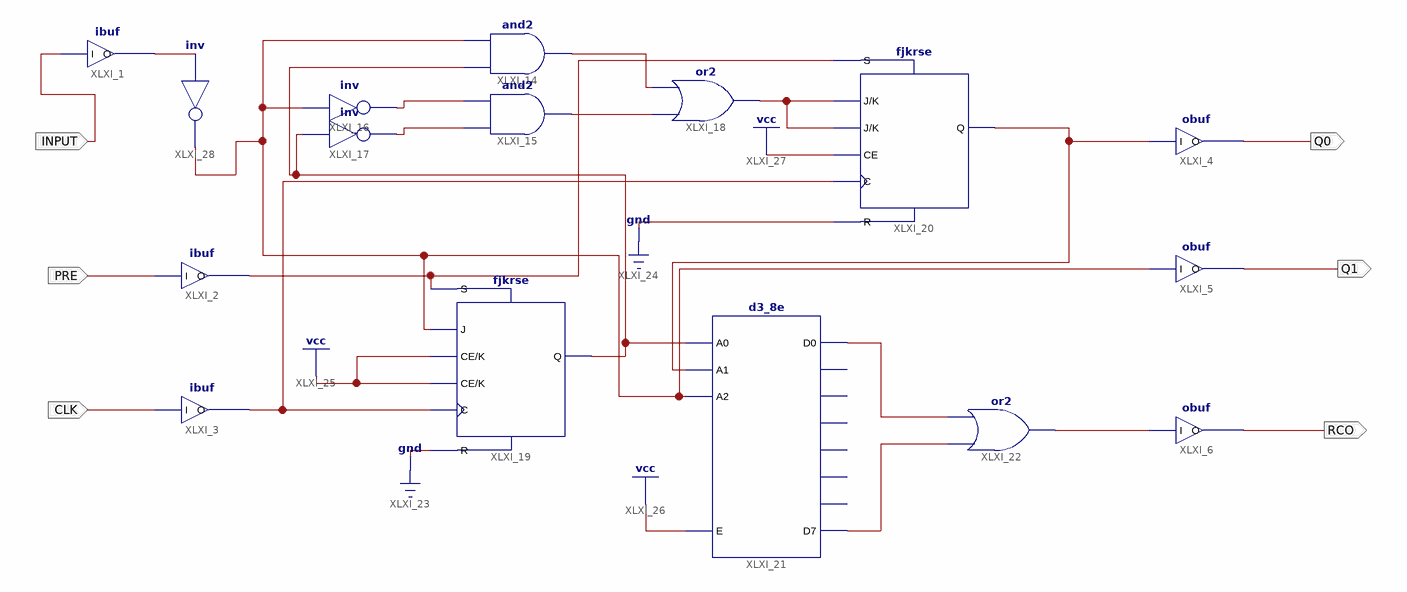
[diagram p0: schematic sheet 1]
// Xilinx ISE schematic top.sch (xc9500) as structural Verilog: 16 symbols, 6 ports
module top (
  input  INPUT,
  input  CLK,
  input  PRE,
  output Q0,
  output Q1,
  output RCO
);

  wire XLXN_24, XLXN_31, XLXN_32, XLXN_33, XLXN_35, XLXN_36, XLXN_39, XLXN_41, XLXN_42, XLXN_43, XLXN_44,
       XLXN_71, XLXN_72, XLXN_81;

  ibuf XLXI_1 (.I(INPUT), .O(XLXN_44));
  ibuf XLXI_3 (.I(CLK), .O(XLXN_31));
  ibuf XLXI_2 (.I(PRE), .O(XLXN_72));
  obuf XLXI_4 (.I(XLXN_39), .O(Q0));
  obuf XLXI_6 (.I(XLXN_43), .O(RCO));
  obuf XLXI_5 (.I(XLXN_81), .O(Q1));
  and XLXI_14 (XLXN_35, XLXN_32, XLXN_81);
  and XLXI_15 (XLXN_71, XLXN_33, XLXN_24);
  not XLXI_16 (XLXN_24, XLXN_81);
  not XLXI_17 (XLXN_33, XLXN_32);
  fjkrse XLXI_19 (.C(XLXN_31), .CE(1'b1), .J(XLXN_81), .K(1'b1), .R(1'b0), .S(XLXN_72), .Q(XLXN_32));
  fjkrse XLXI_20 (.C(XLXN_31), .CE(1'b1), .J(XLXN_36), .K(XLXN_36), .R(1'b0), .S(XLXN_72), .Q(XLXN_39));
  d3_8e XLXI_21 (
    .A0(XLXN_32), .A1(XLXN_39), .A2(XLXN_81), .E(1'b1), .D0(XLXN_41), .D7(XLXN_42));  // open: D1, D2, D3, D4, D5, D6
  or XLXI_22 (XLXN_43, XLXN_42, XLXN_41);
  or XLXI_18 (XLXN_36, XLXN_71, XLXN_35);
  not XLXI_28 (XLXN_81, XLXN_44);
endmodule
